# Altium schematic sheet connectors_and_mosfets.SchDoc
size Letter; SheetNumber: 3; SheetTotal: 3
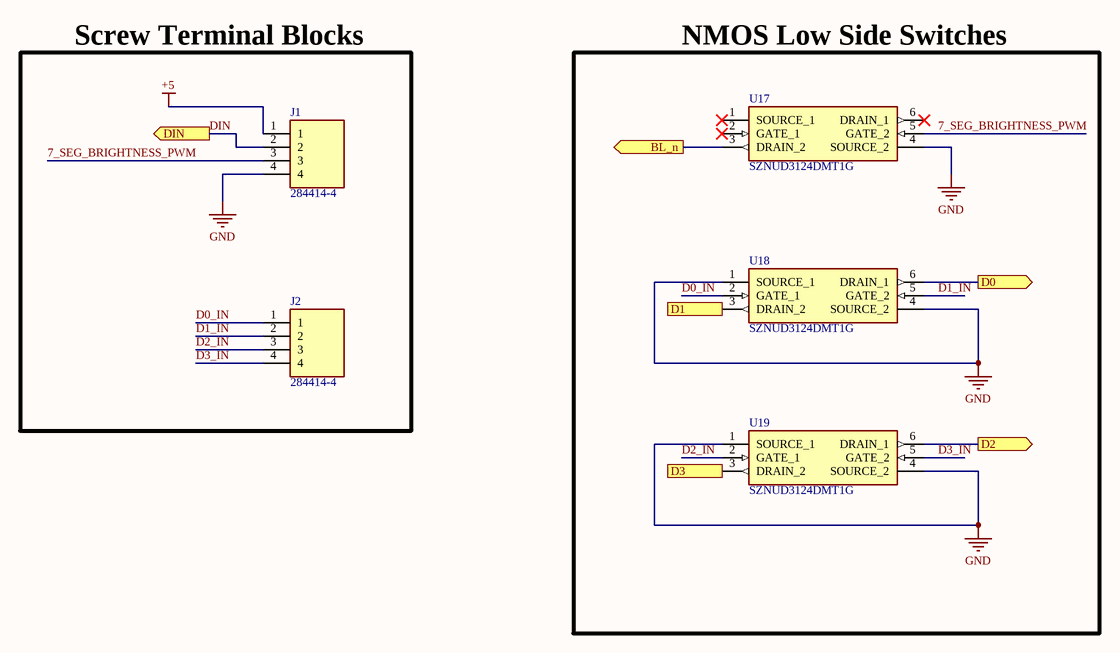
[diagram p0: connectors_and_mosfets.SchDoc]

## Parts
J1  284414-4  [2844144]
J2  284414-4  [2844144]
U17  SZNUD3124DMT1G  [SOT95P275X110-6N]
U18  SZNUD3124DMT1G  [SOT95P275X110-6N]
U19  SZNUD3124DMT1G  [SOT95P275X110-6N]

## Blocks framed on the sheet
Screw Terminal Blocks: J1 J2
NMOS Low Side Switches: U17-U19

## Ports
BL_n (out), D0 (out), D1 (out), D2 (out), D3 (out), DIN (out)

## Nets
+5: J1.1
GND: J1.4 U17.4(SOURCE_2) U18.1(SOURCE_1) U18.4(SOURCE_2) U19.1(SOURCE_1) U19.4(SOURCE_2)
7_SEG_BRIGHTNESS_PWM: J1.3 U17.5(GATE_2)
BL_n: U17.3(DRAIN_2) ; port BL_n
D0: U18.6(DRAIN_1) ; port D0
D0_IN: J2.1 U18.2(GATE_1)
D1: U18.3(DRAIN_2) ; port D1
D1_IN: J2.2 U18.5(GATE_2)
D2: U19.6(DRAIN_1) ; port D2
D2_IN: J2.3 U19.2(GATE_1)
D3: U19.3(DRAIN_2) ; port D3
D3_IN: J2.4 U19.5(GATE_2)
DIN: J1.2 ; port DIN

Not connected (* = marked no-connect by the designer): U17 1(SOURCE_1)* 2(GATE_1)* 6(DRAIN_1)*

## Library data of the parts
J1 J2 = 284414-4: Connector; Manufacturer_Name: TE Connectivity; Datasheet Link: https://www.te.com/commerce/DocumentDelivery/DDEController?Action=srchrtrv&DocNm=1-1773458-1_EURO_STYLE_QRG&DocType=Data%20Sheet&DocLang=English&PartCntxt=284414-4&DocFormat=pdf; Height: 8.35mm; Manufacturer_Part_Number: 284414-4; Mouser Part Number: 571-284414-4; Mouser Price/Stock: https://www.mouser.co.uk/ProductDetail/TE-Connectivity-AMP/284414-4?qs=pW%2FyRk%2FT1EFQM4dD%252BIL6sA%3D%3D
  J1: ComponentLink1Description: digikey; ComponentLink1URL: https://www.digikey.ca/en/products/detail/te-connectivity-amp-connectors/284414-4/1150171
U17-U19 = SZNUD3124DMT1G: Integrated Circuit; Manufacturer_Name: onsemi; Datasheet Link: https://componentsearchengine.com/Datasheets/2/SZNUD3124DMT1G.pdf; Height: 1.1mm; Manufacturer_Part_Number: SZNUD3124DMT1G; Mouser Part Number: 863-SZNUD3124DMT1G; Mouser Price/Stock: https://www.mouser.co.uk/ProductDetail/onsemi/SZNUD3124DMT1G?qs=uarJZ6H%252BeNp%2Fh61aNCid3w%3D%3D; Arrow Part Number: SZNUD3124DMT1G; Arrow Price/Stock: https://www.arrow.com/en/products/sznud3124dmt1g/on-semiconductor?region=nac